# Altium project diapers1.PrjPcb
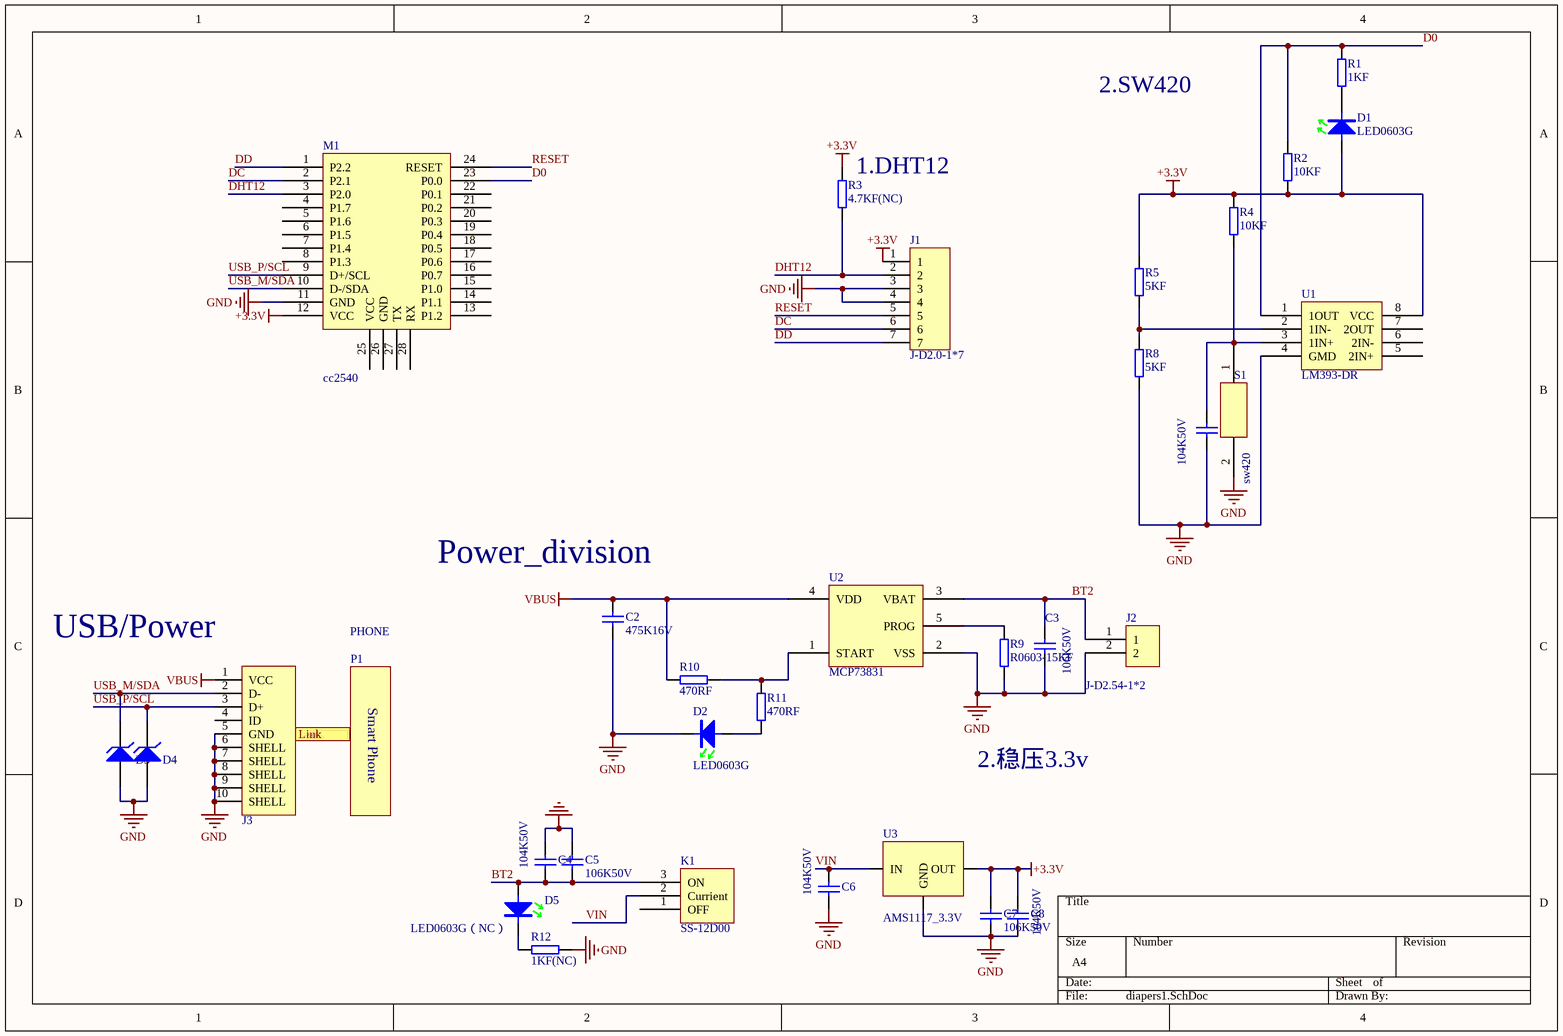
[diagram p0: diapers1.SchDoc]
1 sheet, 33 parts. Net scope: flat (ports and power ports of the same name join across sheets).
Board file: diapers1.PcbDoc

## Sheet diapers1.SchDoc
size A4

### Parts
C1  104K50V  [C0603]
C2  475K16V  [C0603]
C3  106K50V  [C0603]
C4  104K50V  [C0603]
C5  106K50V  [C0603]
C6  104K50V  [C0603]
C7  106K50V  [C0603]
C8  104K50V  [C0603]
D1  LED0603G  [D-LED0603G]
D2  LED0603G  [D-LED0603G]
D3  ESDA_TR1/0603  [HS_0603D]  (value not drawn)
D4  ESDA_TR1/0603  [HS_0603D]  (value not drawn)
D5  LED0603G（NC）  [D-LED0603G]
J1  J-D2.0-1*7  [D-2.0-1*7]
J2  J-D2.54-1*2  [D2.54-1*2P]
J3  USB-MINI-SOCKET  [MICRO-USB - 5.9]  (value not drawn)
K1  SS-12D00  [SS-12D00]
M1  cc2540
P1  PHONE
R1  1KF  [R0603]
R2  10KF  [R0603]
R3  4.7KF(NC)  [R0603]
R4  10KF  [R0603]
R5  5KF  [R0603]
R8  5KF  [R0603]
R9  R0603-15KF  [R0603]
R10  470RF  [R0603]
R11  470RF  [R0603]
R12  1KF(NC)  [R0603]
S1  sw420  [sw420]
U1  LM393-DR  [LM393]
U2  MCP73831  [SOT23-5N]
U3  AMS1117_3.3V  [SOT-223]

### Ports
Link

### Nets
+3.3V: C7.2 C8.1 D1.1 J1.1 M1.12(VCC) R2.1 R3.2 R4.2 R5.2 U1.8(VCC) U3.2(OUT)
GND: C1.2 C2.2 C3.2 C4.1 C5.2 C6.2 C7.1 C8.2 D2.2 D3.1(A) D4.1(A) J1.3 J1.4 J2.2 J3.5(GND) J3.6(SHELL) J3.7(SHELL) J3.8(SHELL) J3.9(SHELL) J3.10(SHELL) M1.11(GND) R8.1 R9.1 R12.2 U1.4(GMD) U2.2(VSS) U3.1(GND)
VBUS: C2.1 J3.1(VCC) R10.1 U2.4(VDD)
BT2: C3.1 C4.2 C5.1 D5.1 J2.1 K1.3(ON) U2.3(VBAT)
D0: M1.23(P0.0) R1.1 R2.2 U1.1(1OUT)
DC: J1.6 M1.2(P2.1)
DD: J1.7 M1.1(P2.2)
DHT12: J1.2 M1.3(P2.0) R3.1
RESET: J1.5 M1.24(RESET)
USB_M/SDA: D3.2(K) J3.2(D-) M1.10(D-/SDA)
USB_P/SCL: D4.2(K) J3.3(D+) M1.9(D+/SCL)
VIN: C6.1 K1.2(Currient) U3.3(IN)
NetC1_1: C1.1 R4.1 S1.1 U1.3(1IN+)
NetD1_2: D1.2 R1.2
NetD2_1: D2.1 R11.1
NetD5_2: D5.2 R12.1
NetR5_1: R5.1 R8.2 U1.2(1IN-)
NetR9_2: R9.2 U2.5(PROG)
NetR10_2: R10.2 R11.2 U2.1(START)

Not connected (* = marked no-connect by the designer): J3 4(ID); K1 1(OFF); M1 4(P1.7) 5(P1.6) 6(P1.5) 7(P1.4) 8(P1.3) 13(P1.2) 14(P1.1) 15(P1.0) 16(P0.7) 17(P0.6) 18(P0.5) 19(P0.4) 20(P0.3) 21(P0.2) 22(P0.1) 25(VCC) 26(GND) 27(TX) 28(RX); S1 2; U1 5(2IN+) 6(2IN-) 7(2OUT)

### Notes on the sheet
- 2.SW420
- (near R3) 1.DHT12
- (near C2) Power_division
- (near J3) USB/Power
- 2.稳压3.3v
- Labels drawn without touching a wire or pin: GND
- (in symbol PHONE) Smart Phone

### Library data of the parts
C1 C4 C6 C8 = C0603X7R-104K50V: 贴片电容-陶瓷; 规格型号: 100nF±10%_50V_X7R_C0603; 生产商: 风华 三星; 供应商: *; 备注: *
C2 = C0603X7R-475K16V: 贴片电容-陶瓷; 规格型号: 4.7uF±10%_16V_X7R_C0603; 生产商: 风华 三星; 供应商: *; 备注: *
C3 C5 C7 = C0603X7R-106K50V: 贴片电容-陶瓷; 规格型号: 10uF±10%_50V_X7R_C0603; 生产商: 风华 三星; 供应商: *; 备注: *
D1 D2 D5 = DLED-0603-G: 贴片二极管-LED; 规格型号: 0603-GREEN; 货品编码: 无样品无编码; 生产商: *; 供应商: *; 备注: *
D3 D4 = D Zener: Zener Diode; Published: *; LatestRevisionDate: *; LatestRevisionNote: *; PackageReference: *; Publisher: *
J1 = J-D2.0-1*7单排
J2 = J-D2.54-1*2单排
J3 = J-USB-MINI-SOCKET: USB-A卧式插座; 供应商: *; 备注: *
K1 = SS-12D00(1P2T) 立式 柄高5MM
R1 R12 = R0603-1KF: 贴片电阻-通用; 生产商: 厚声 国巨; 规格型号: 1K±1%_1/10W_±200ppm_R0603; 货品编码: 无样品无编码; 备注: *; 供应商: *
R2 R4 R5 R8 = R0603-10KF: 贴片电阻-通用; 生产商: 厚声 国巨; 规格型号: 10K±1%_1/10W_±200ppm_R0603; 备注: *; 供应商: *
R3 = R0603-4.7KF: 贴片电阻-通用; 生产商: 厚声 国巨; 规格型号: 4.7K±1%_1/10W_±200ppm_R0603; 货品编码: 无样品无编码; 备注: *; 供应商: *
R9 = R0603-15KF: 贴片电容-通用
R10 R11 = R0603-470RF: 贴片电阻-通用; 生产商: 厚声 国巨; 规格型号: 470R±1%_1/10W_±200ppm_R0603; 货品编码: 无样品无编码; 备注: *; 供应商: *
S1 = sw420: 常闭振动传感器
U1 = LM393-DR: 双路比较器
U2 = MCP73831: charge IC
U3 = AMS1117-3.3V